# EAGLE schematic untitled (EAGLE 7.2.0)

## Sheet 1 of 6
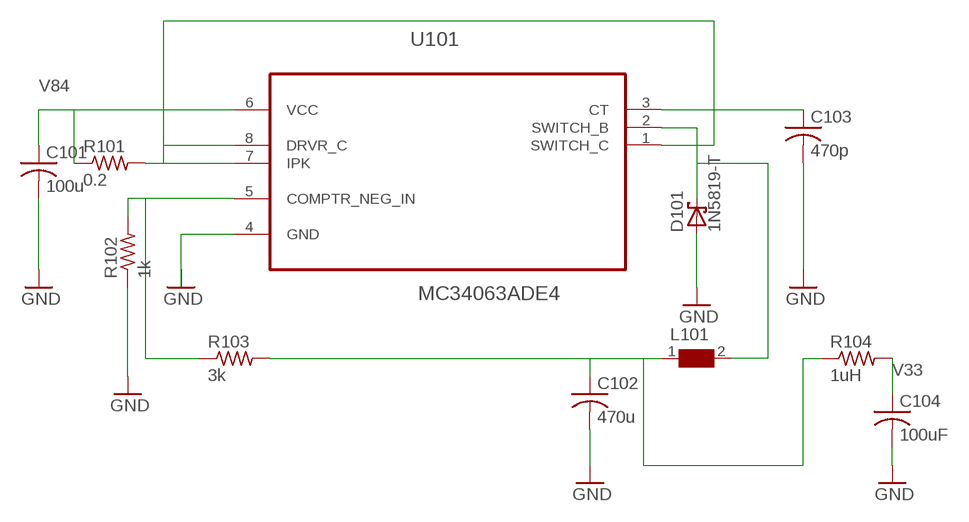
[diagram p0: schematic, sheet 1]

### Parts
C101  100u  C-USC0805  [C0805]
C102  470u  C-USC0805  [C0805]
C103  470p  C-USC0805  [C0805]
C104  100uF  C-USC0805  [C0805]
D101  1N5819-T  [DO41-7.6]
L101  WE-PD-7447714101_1030/1050  [WE-PD_1030/1050]
R101  0.2  R-US_R0805  [R0805]
R102  1k  R-US_R0805  [R0805]
R103  3k  R-US_R0805  [R0805]
R104  1uH  R-US_R0805  [R0805]
U101  MC34063ADE4  [SOIC127P600X175-8N]

### Nets
GND: C101.2 C102.2 C103.2 C104.2 D101.A R102.1 U101.4(GND) ; also sheet 2,3,4,5,6
N$2: C103.1 U101.3(CT)
N$3: R102.2 R103.1 U101.5(COMPTR_NEG_IN)
N$4: C102.1 L101.1 R103.2 R104.1
N$5: R101.2 U101.1(SWITCH_C) U101.7(IPK) U101.8(DRVR_C)
N$6: D101.C L101.2 U101.2(SWITCH_B)
V33: C104.1 R104.2 ; also sheet 4,5,6
V84: C101.1 R101.1 U101.6(VCC) ; also sheet 2,3,5

## Sheet 2 of 6
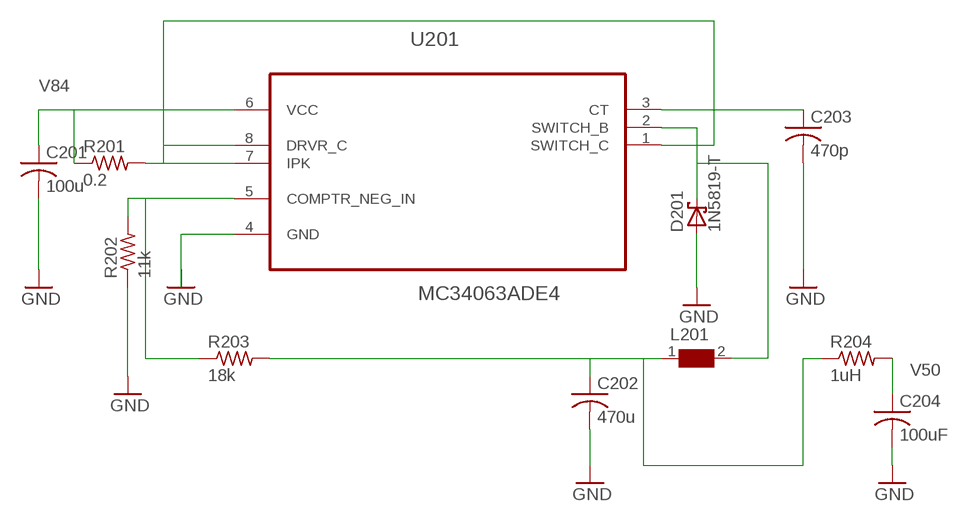
[diagram p1: schematic, sheet 2]

### Parts
C201  100u  C-USC0805  [C0805]
C202  470u  C-USC0805  [C0805]
C203  470p  C-USC0805  [C0805]
C204  100uF  C-USC0805  [C0805]
D201  1N5819-T  [DO41-7.6]
L201  WE-PD-7447714101_1030/1050  [WE-PD_1030/1050]
R201  0.2  R-US_R0805  [R0805]
R202  11k  R-US_R0805  [R0805]
R203  18k  R-US_R0805  [R0805]
R204  1uH  R-US_R0805  [R0805]
U201  MC34063ADE4  [SOIC127P600X175-8N]

### Nets
GND: C201.2 C202.2 C203.2 C204.2 D201.A R202.1 U201.4(GND) ; also sheet 1,3,4,5,6
N$1: C203.1 U201.3(CT)
N$7: R202.2 R203.1 U201.5(COMPTR_NEG_IN)
N$8: C202.1 L201.1 R203.2 R204.1
N$9: R201.2 U201.1(SWITCH_C) U201.7(IPK) U201.8(DRVR_C)
N$10: D201.C L201.2 U201.2(SWITCH_B)
V50: C204.1 R204.2 ; also sheet 5,6
V84: C201.1 R201.1 U201.6(VCC) ; also sheet 1,3,5

## Sheet 3 of 6
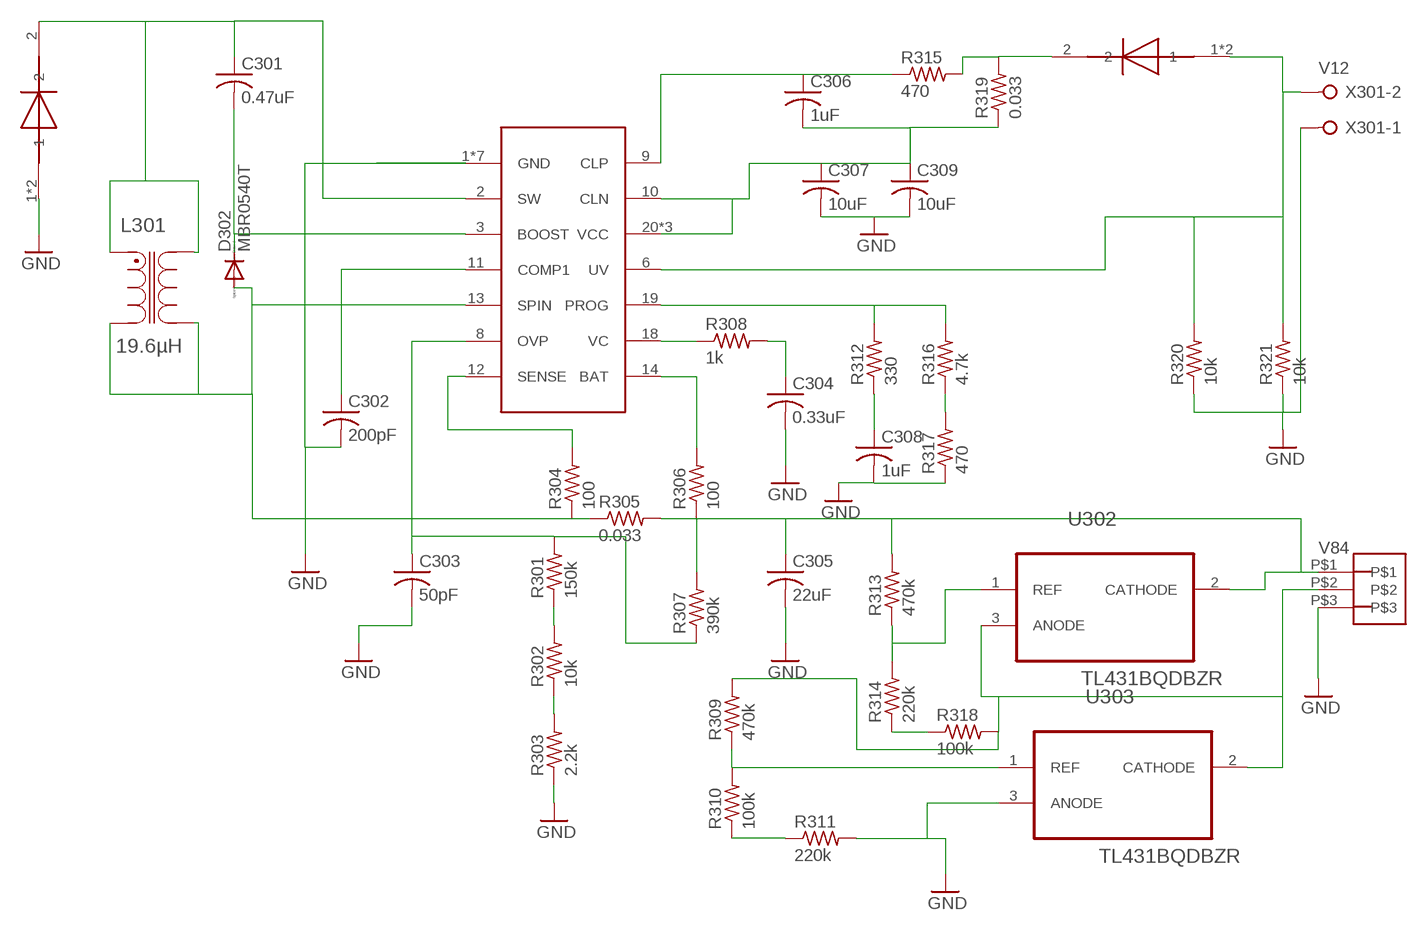
[diagram p2: schematic, sheet 3]

### Parts
C301  0.47uF  C-USC0805  [C0805]
C302  200pF  C-USC0805  [C0805]
C303  50pF  C-USC0805  [C0805]
C304  0.33uF  C-USC0805  [C0805]
C305  22uF  C-USC0805  [C0805]
C306  1uF  C-USC0805  [C0805]
C307  10uF  C-USC0805  [C0805]
C308  1uF  C-USC0805  [C0805]
C309  10uF  C-USC0805  [C0805]
D301  MBRD340  [DPACK]
D302  MBR0540T  CGRM4006-G  [SOD-123_MINI-SMA]
D303  MBRD340  [DPACK]
J301  3_PIN_JST-XH  [3_PIN_JST-XH]
L301  19.6µH  CTX20-4-R  [INDM115115X635N]
R301  150k  R-US_R0805  [R0805]
R302  10k  R-US_R0805  [R0805]
R303  2.2k  R-US_R0805  [R0805]
R304  100  R-US_R0805  [R0805]
R305  0.033  R-US_R0805  [R0805]
R306  100  R-US_R0805  [R0805]
R307  390k  R-US_R0805  [R0805]
R308  1k  R-US_R0805  [R0805]
R309  470k  R-US_R0805  [R0805]
R310  100k  R-US_R0805  [R0805]
R311  220k  R-US_R0805  [R0805]
R312  330  R-US_R0805  [R0805]
R313  470k  R-US_R0805  [R0805]
R314  220k  R-US_R0805  [R0805]
R315  470  R-US_R0805  [R0805]
R316  4.7k  R-US_R0805  [R0805]
R317  470  R-US_R0805  [R0805]
R318  100k  R-US_R0805  [R0805]
R319  0.033  R-US_R0805  [R0805]
R320  10k  R-US_R0805  [R0805]
R321  10k  R-US_R0805  [R0805]
U301  LT1511  [SO24W]
U302  TL431BQDBZR  [SOT95P237X112-3N]
U303  TL431BQDBZR  [SOT95P237X112-3N]
X301  W237-02P  [W237-132]

### Nets
GND: C302.2 C303.2 C304.2 C305.2 C307.2 C308.2 C309.2 D301.1 D301.3 J301.P$3 R303.1 R311.2 R317.1 R320.1 R321.1 U301.1(GND) U301.4(GND) U301.5(GND) U301.7(GND) U301.16(GND) U301.23(GND) U301.24(GND) U303.3(ANODE) X301.1 ; also sheet 1,2,4,5,6
N$11 [power1]: C301.1 D301.2 L301.1 L301.4 U301.2(SW)
N$12 [power1]: D302.A L301.2 L301.3 R304.1 R305.1 U301.13(SPIN)
N$13: C301.2 D302.C U301.3(BOOST)
N$14: C302.1 U301.11(COMP1)
N$15: R304.2 U301.12(SENSE)
N$16: R306.2 U301.14(BAT)
N$17: R308.1 U301.18(VC)
N$18: C304.1 R308.2
N$19: R312.2 R316.2 U301.19(PROG)
N$20: C308.1 R312.1
N$21 [power1]: C306.2 C307.1 C309.1 R319.1 U301.10(CLN) U301.20(VCC) U301.21(VCC) U301.22(VCC)
N$22 [power1]: C306.1 R315.1 U301.9(CLP)
N$23 [power1]: D303.2 R315.2 R319.2
N$24: R301.1 R302.2
N$25 [power1]: R302.1 R303.2
N$26: R316.1 R317.2
N$27 [power1]: C303.1 R301.2 R307.1 U301.8(OVP)
N$28: R314.1 R318.1
N$29: R313.1 R314.2 U302.1(REF)
N$30: R309.1 R310.2 U303.1(REF)
N$31: R310.1 R311.1
N$32: J301.P$2 R309.2 R318.2 U302.3(ANODE) U303.2(CATHODE)
V12 [power1]: D303.1 D303.3 R320.2 R321.2 U301.6(UV) X301.2
V84: C305.1 J301.P$1 R305.2 R306.1 R307.2 R313.2 U302.2(CATHODE) ; also sheet 1,2,5

## Sheet 4 of 6
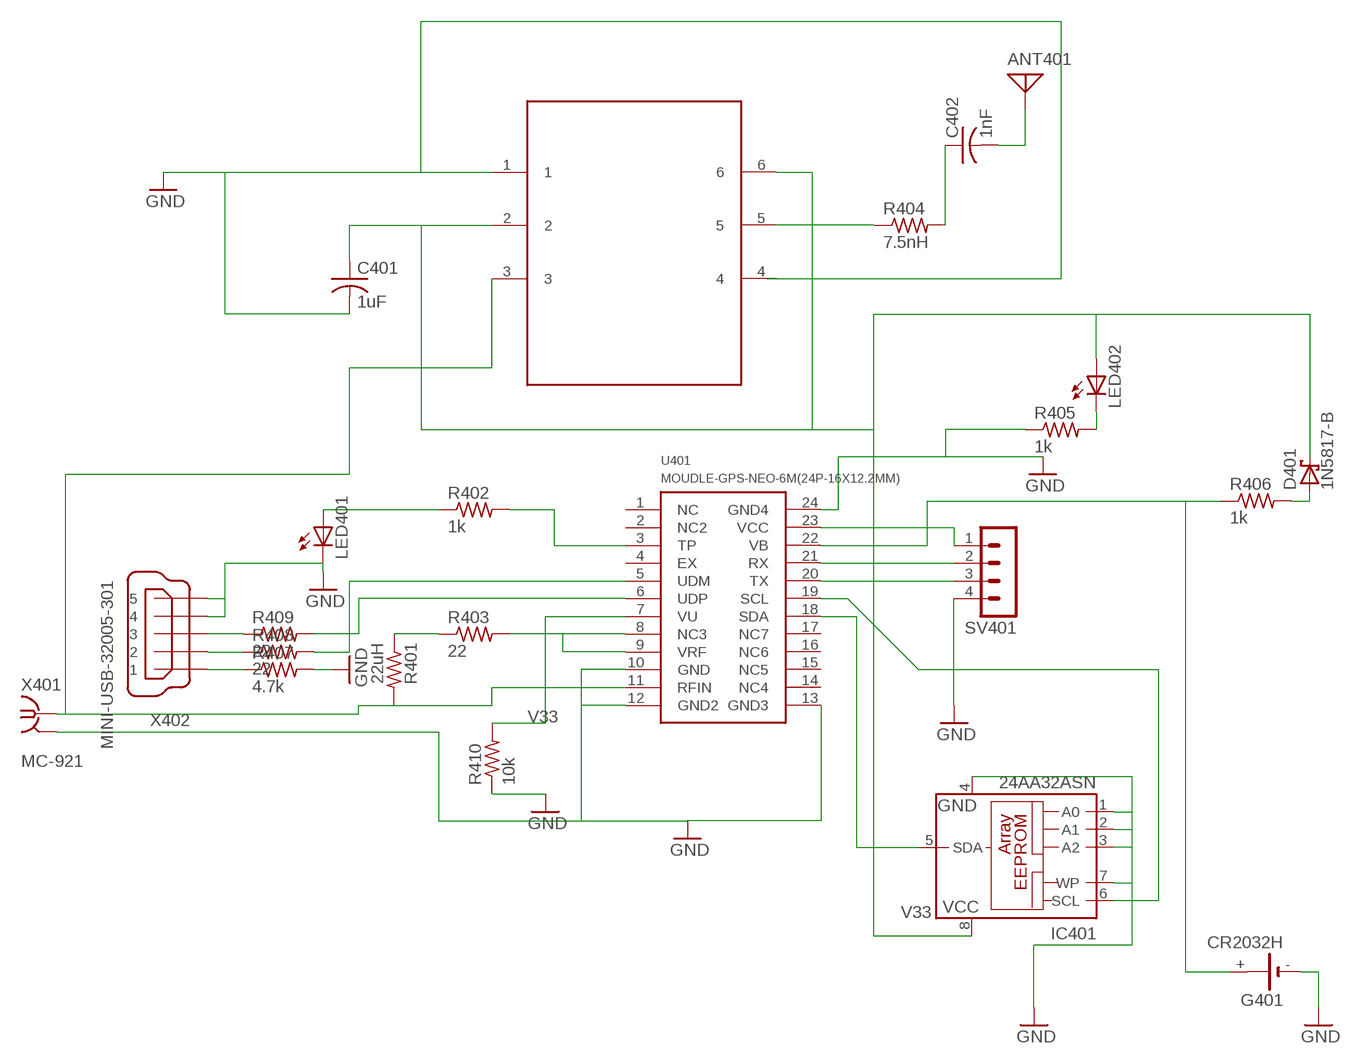
[diagram p3: schematic, sheet 4]

### Parts
ANT401  ANTENNA  [PAD-01]
C401  1uF  C-USC0603  [C0603]
C402  1nF  C-USC0603  [C0603]
D401  1N5817-B  [DO41-7.6]
G401  CR2032H  [CR2032H]
IC401  24AA32ASN  [SO-08]
LED401  LEDCHIP-LED0805  [CHIP-LED0805]
LED402  LEDCHIP-LED0805  [CHIP-LED0805]
R401  22uH  R-US_R0603  [R0603]
R402  1k  R-US_R0805  [R0805]
R403  22  R-US_R0603  [R0603]
R404  7.5nH  R-US_R0603  [R0603]
R405  1k  R-US_R0805  [R0805]
R406  1k  R-US_R0805  [R0805]
R407  4.7k  R-US_R0603  [R0603]
R408  22  R-US_R0603  [R0603]
R409  22  R-US_R0603  [R0603]
R410  10k  R-US_R0603  [R0603]
SV401  MA04-1  [MA04-1]
U401  MOUDLE-GPS-NEO-6M(24P-16X12.2MM)  [GPS24P-SMD-1.1-16X12.2MM]
U402  INF-TSLP-6-2_V_1  [INF-TSLP-6-2_V_1PRIMARY]
X401  MC-921  [MC-921]
X402  MINI-USB-32005-301  [32005-301]

### Nets
GND: C401.2 G401.- IC401.1(A0) IC401.2(A1) IC401.3(A2) IC401.4(GND) IC401.7(WP) LED401.C R405.1 R407.2 R410.1 SV401.4 U401.10(GND) U401.12(GND2) U401.13(GND3) U401.24(GND4) U402.1 X401.2@1(GND) X401.2@2(GND) X402.4 X402.5 ; also sheet 1,2,3,5,6
N$33: LED401.A R402.1
N$34: SV401.3 U401.20(TX)
N$35: SV401.2 U401.21(RX)
N$36: IC401.6(SCL) U401.19(SCL)
N$37: IC401.5(SDA) U401.18(SDA)
N$38: R402.2 U401.3(TP)
N$39: R403.2 U401.8(NC3) U401.9(VRF)
N$40: G401.+ R406.1 U401.22(VB)
N$41: D401.A R406.2
N$42: LED402.C R405.2
N$43: R401.1 R403.1
N$44: R408.2 U401.5(UDM)
N$45: R409.2 U401.6(UDP)
N$46 [power1]: ANT401.1 C402.2
N$47 [power1]: R401.2 U401.11(RFIN) U402.3 X401.1
N$48: R404.1 U402.5
N$49: C402.1 R404.2
N$107: R407.1 X402.1
N$108: R409.1 X402.3
N$109: R408.1 X402.2
V33: C401.1 D401.C IC401.8(VCC) LED402.A R410.2 SV401.1 U401.7(VU) U401.23(VCC) U402.2 U402.6 ; also sheet 1,5,6
Unconnected: G401.+@1(+) U401.1(NC) U401.2(NC2) U401.4(EX) U401.14(NC4) U401.15(NC5) U401.16(NC6) U401.17(NC7) U402.4

## Sheet 5 of 6
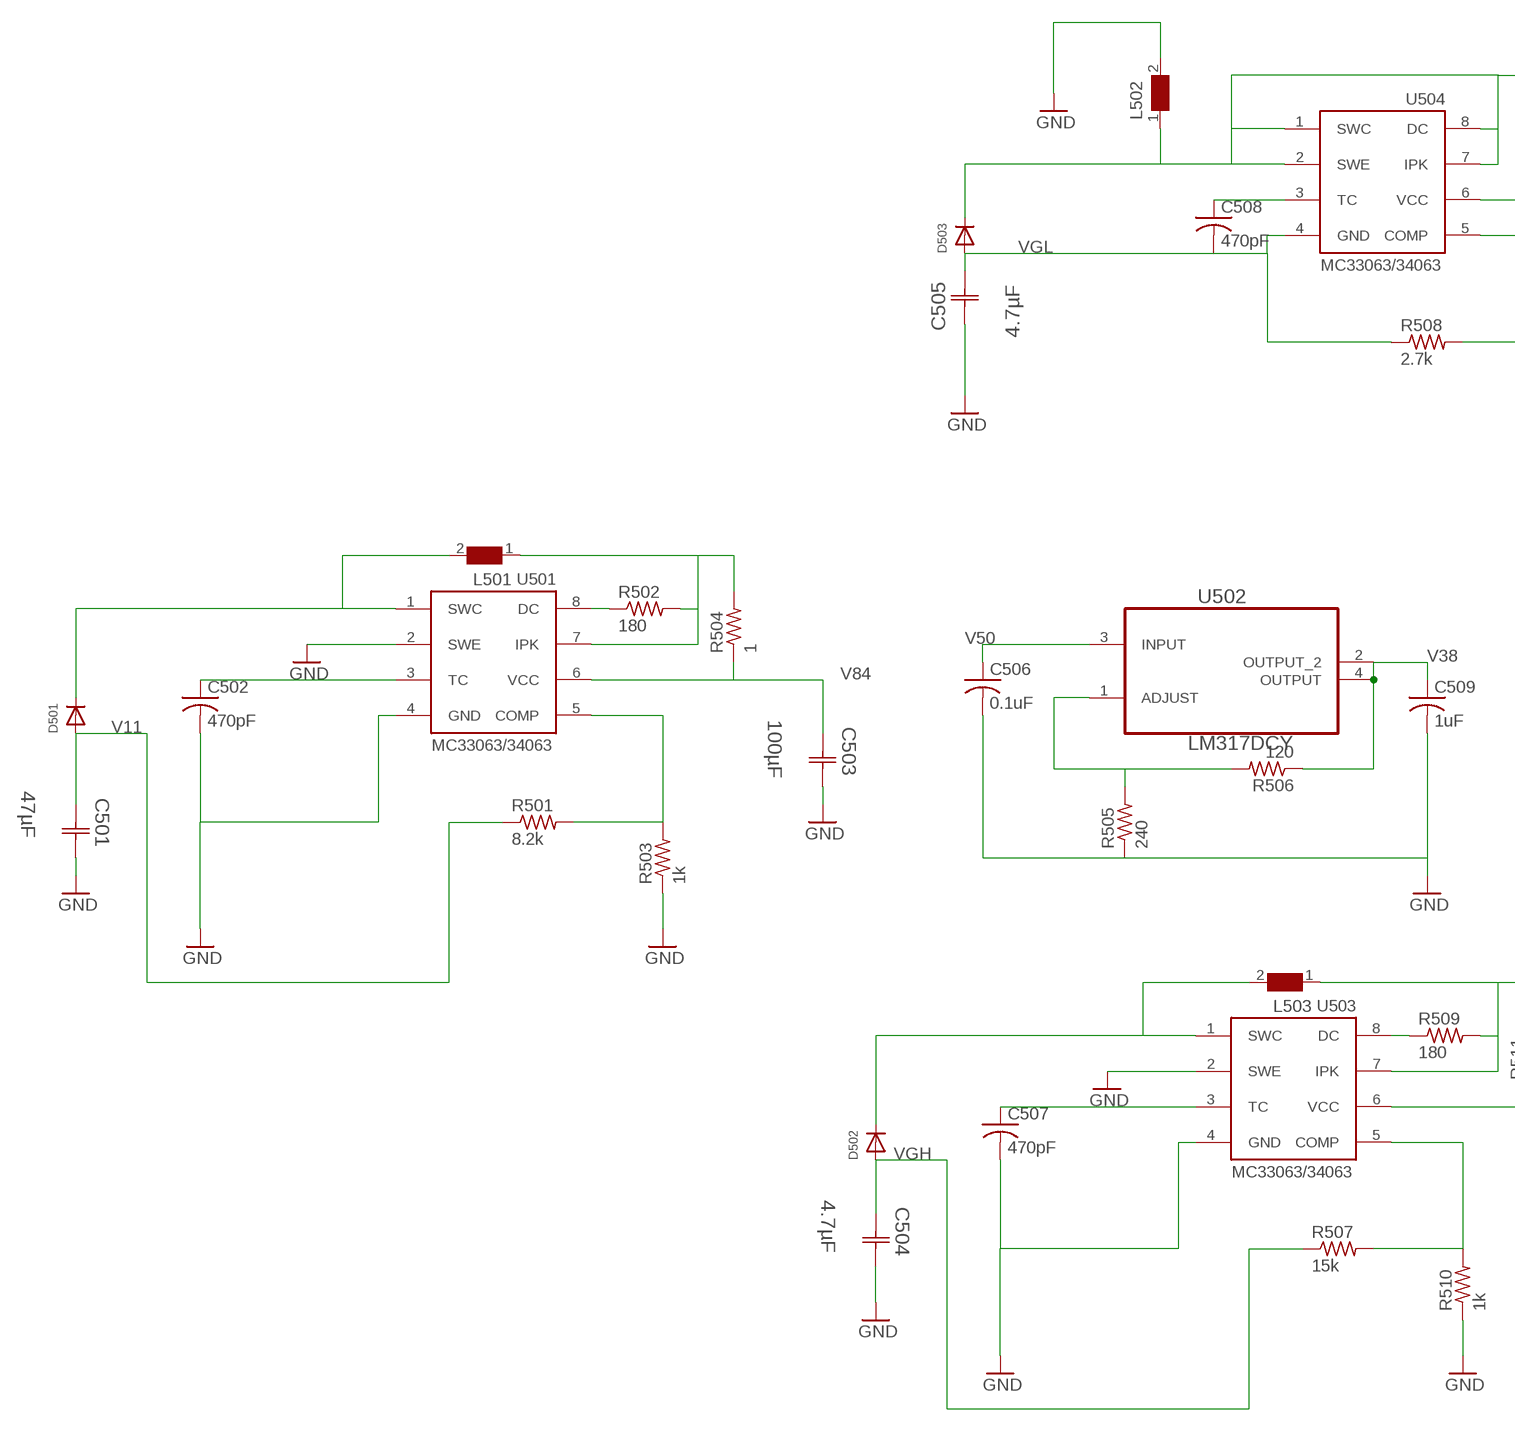
[diagram p4: schematic, sheet 5, part 1 of 3]
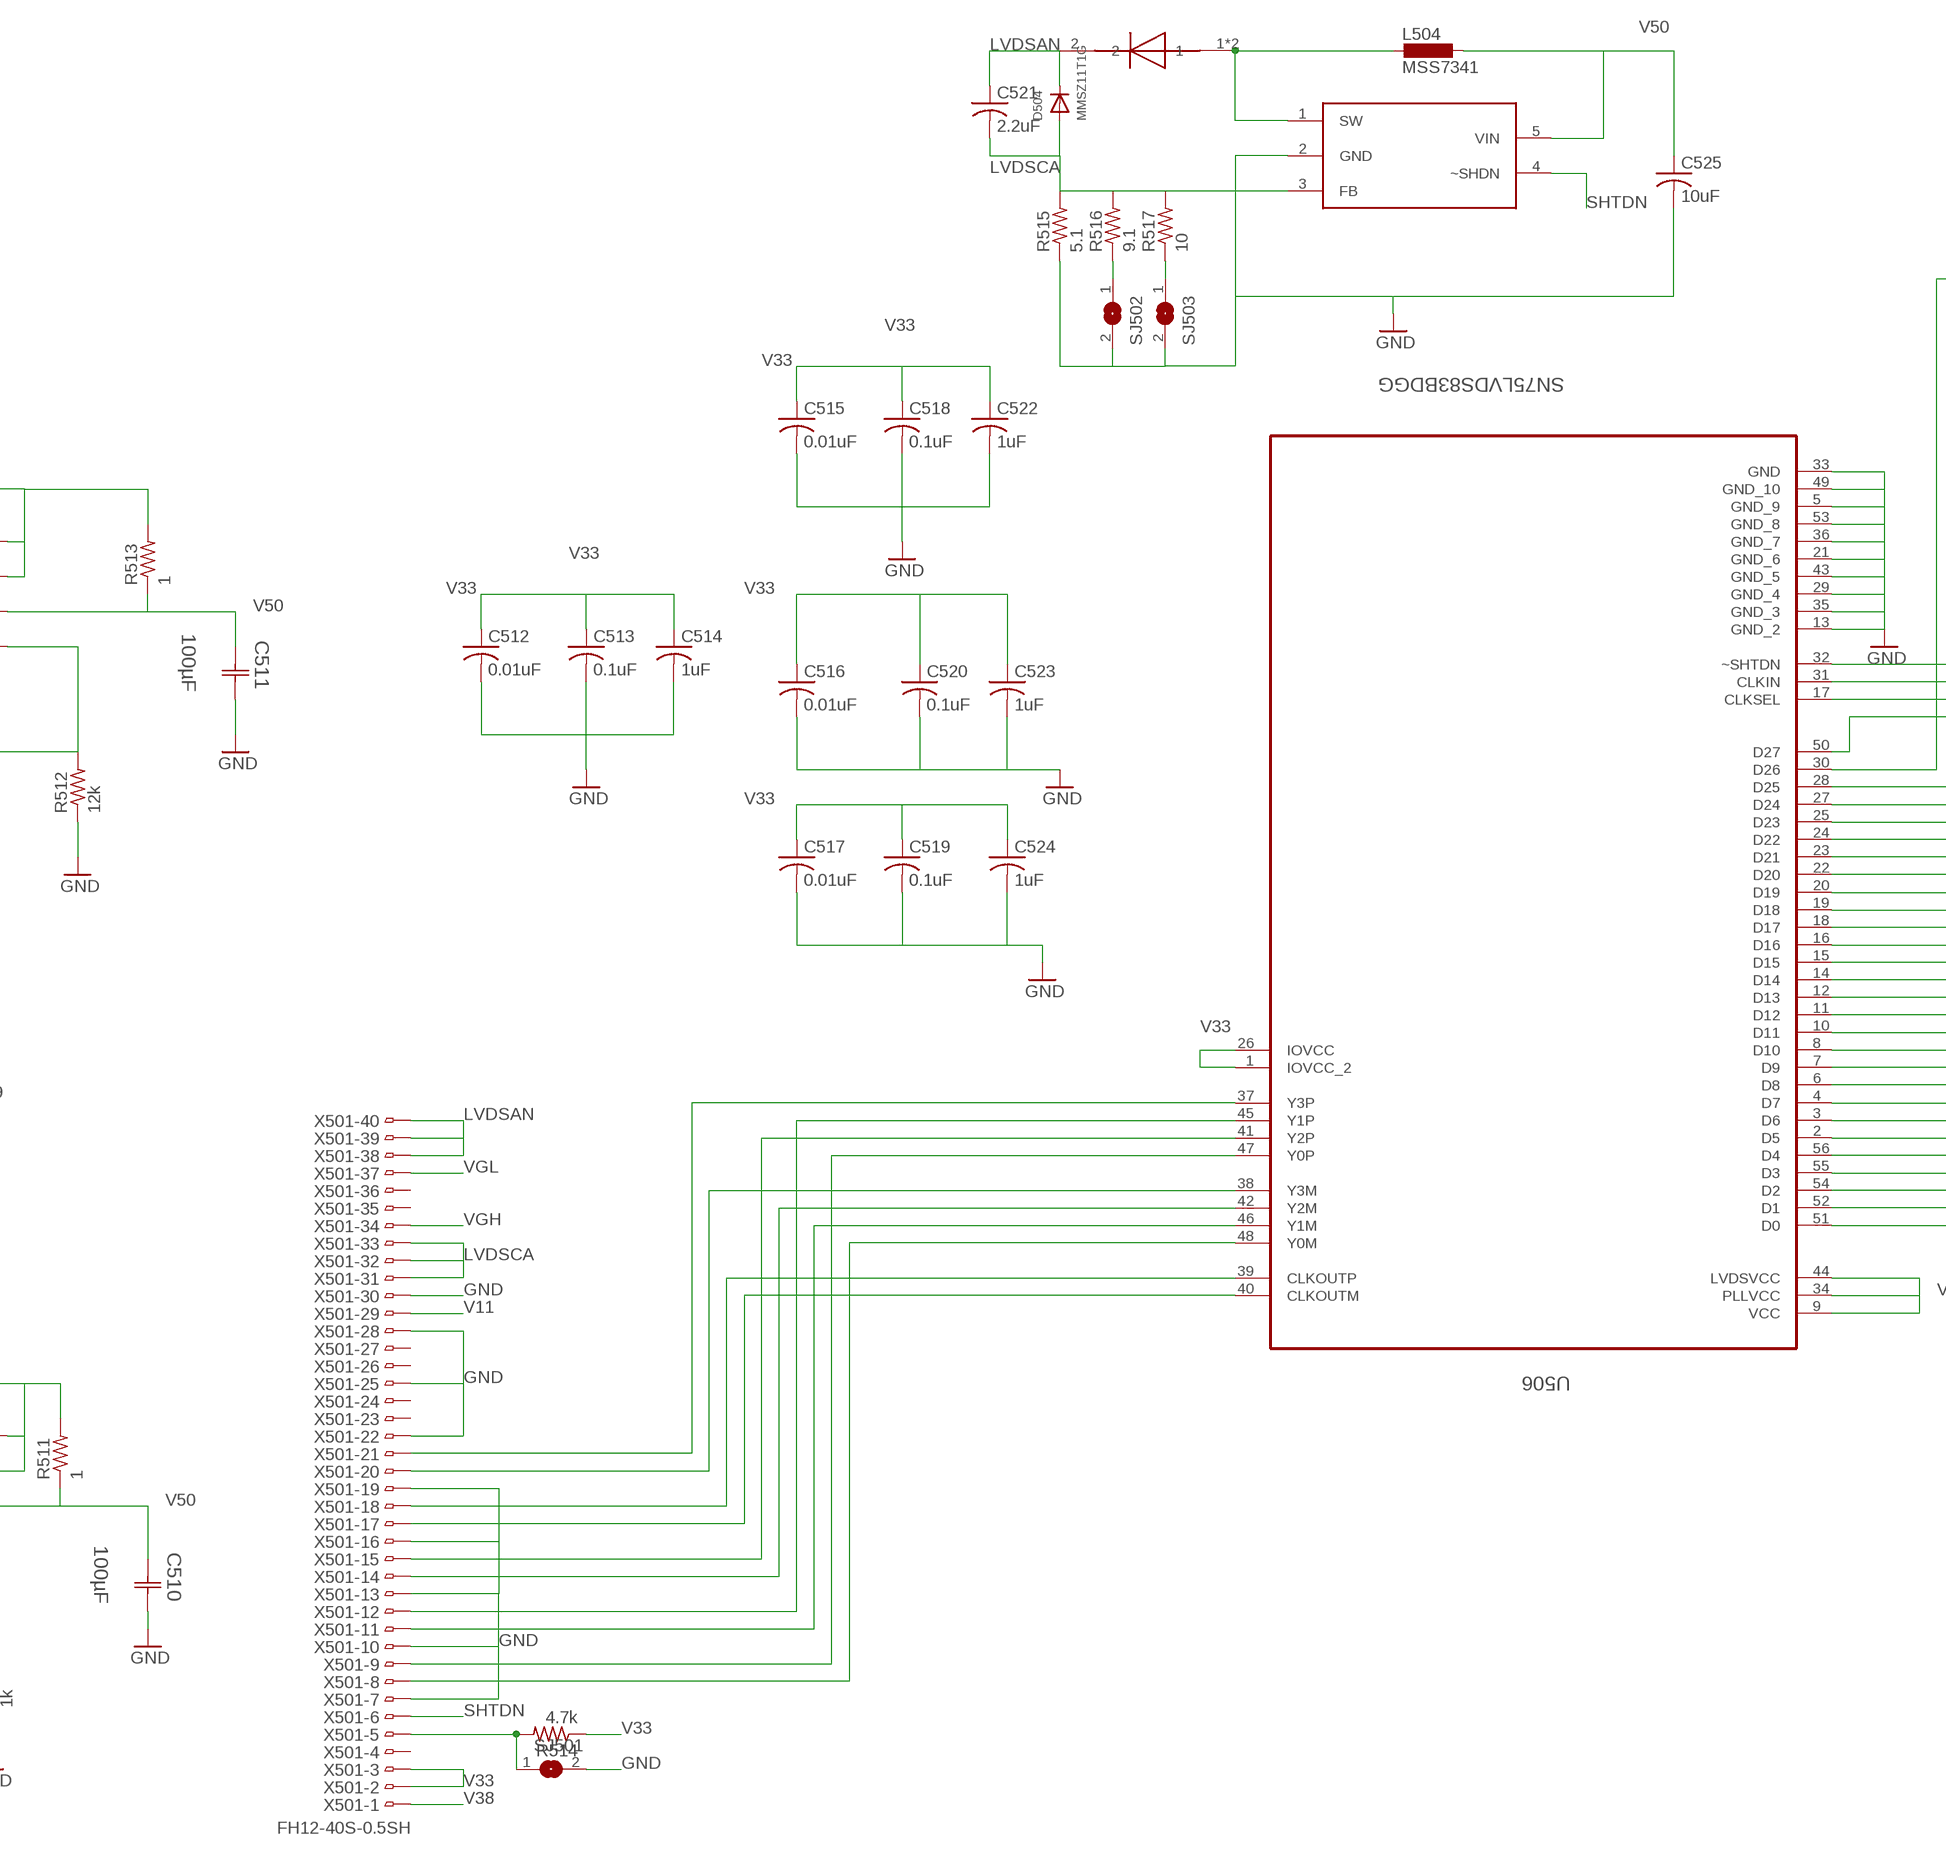
[diagram p5: schematic, sheet 5, part 2 of 3]
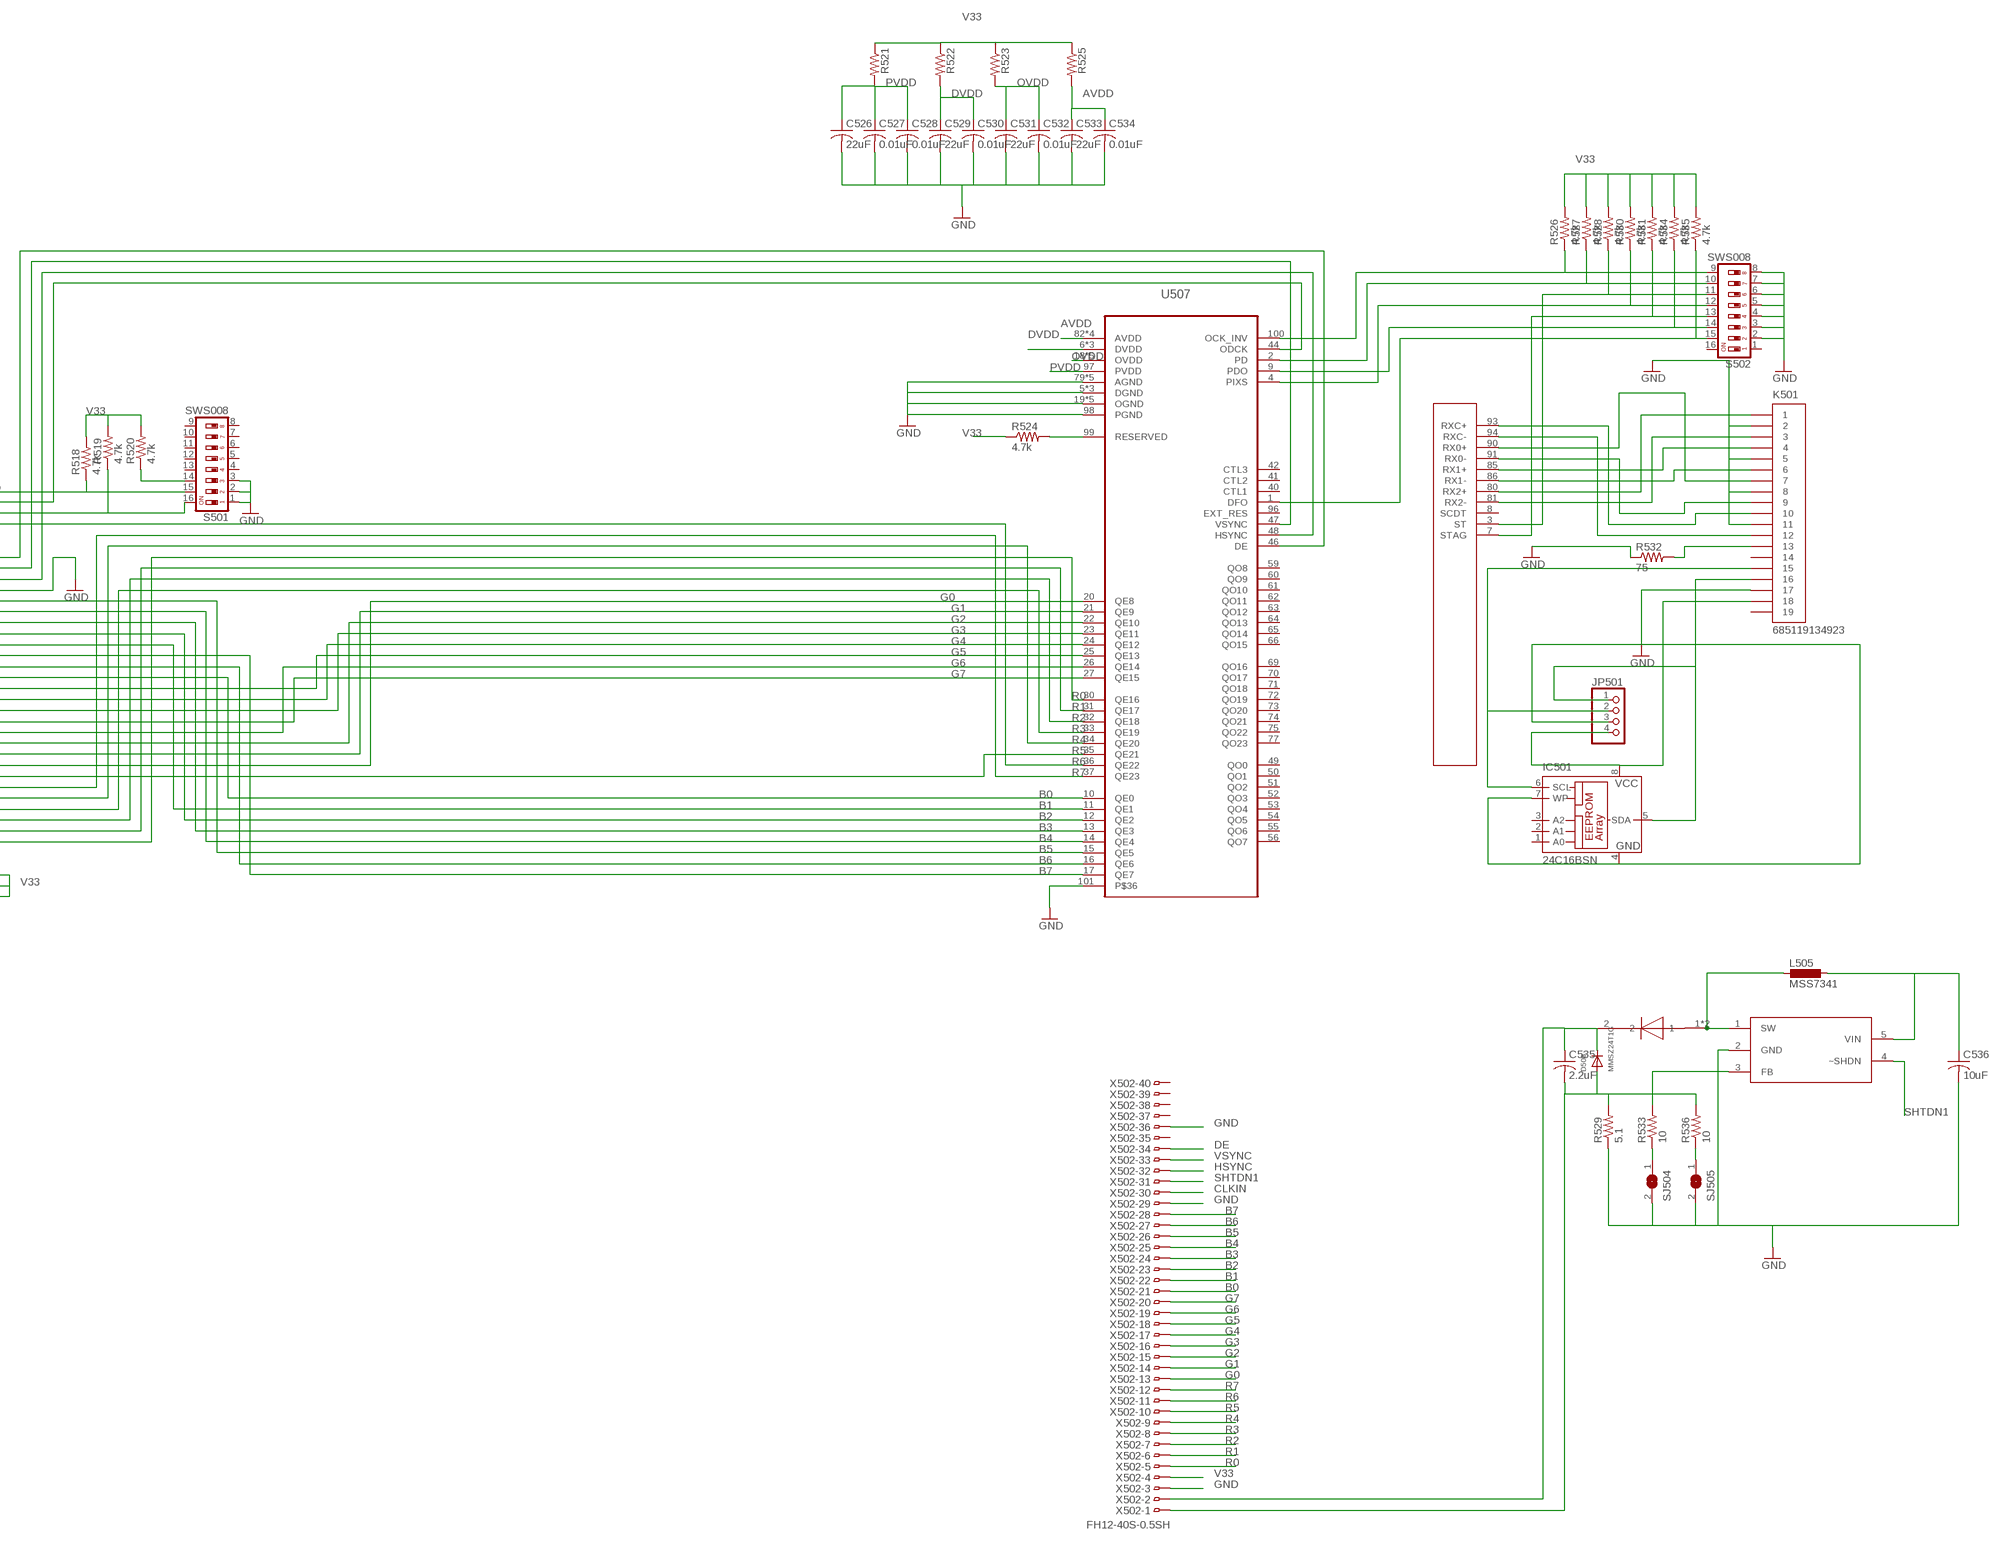
[diagram p6: schematic, sheet 5, part 3 of 3]

### Parts
C501  47µF  TAJC106M020R  [CAPCP6032X280N]
C502  470pF  C-USC0603  [C0603]
C503  100µF  TAJC106M020R  [CAPCP6032X280N]
C504  4.7µF  TAJC106M020R  [CAPCP6032X280N]
C505  4.7µF  TAJC106M020R  [CAPCP6032X280N]
C506  0.1uF  C-USC0603  [C0603]
C507  470pF  C-USC0603  [C0603]
C508  470pF  C-USC0603  [C0603]
C509  1uF  C-USC0603  [C0603]
C510  100µF  TAJC106M020R  [CAPCP6032X280N]
C511  100µF  TAJC106M020R  [CAPCP6032X280N]
C512  0.01uF  C-USC0603  [C0603]
C513  0.1uF  C-USC0603  [C0603]
C514  1uF  C-USC0603  [C0603]
C515  0.01uF  C-USC0603  [C0603]
C516  0.01uF  C-USC0603  [C0603]
C517  0.01uF  C-USC0603  [C0603]
C518  0.1uF  C-USC0603  [C0603]
C519  0.1uF  C-USC0603  [C0603]
C520  0.1uF  C-USC0603  [C0603]
C521  2.2uF  C-USC0805  [C0805]
C522  1uF  C-USC0603  [C0603]
C523  1uF  C-USC0603  [C0603]
C524  1uF  C-USC0603  [C0603]
C525  10uF  C-USC0805  [C0805]
C526  22uF  C-USC0603  [C0603]
C527  0.01uF  C-USC0603  [C0603]
C528  0.01uF  C-USC0603  [C0603]
C529  22uF  C-USC0603  [C0603]
C530  0.01uF  C-USC0603  [C0603]
C531  22uF  C-USC0603  [C0603]
C532  0.01uF  C-USC0603  [C0603]
C533  22uF  C-USC0603  [C0603]
C534  0.01uF  C-USC0603  [C0603]
C535  2.2uF  C-USC0805  [C0805]
C536  10uF  C-USC0805  [C0805]
D501  DIODESOD-123  [SOD-123]
D502  DIODESOD-123  [SOD-123]
D503  DIODESOD-123  [SOD-123]
D504  MMSZ11T1G  DIODESOD-123  [SOD-123]
D505  MBRD340  [DPACK]
D506  MMSZ24T1G  DIODESOD-123  [SOD-123]
D507  MBRD340  [DPACK]
IC501  24C16BSN  [SO-08]
JP501  PINHD-1X4  [1X04]
K501  685119134923  [685119134923]
L501  WE-PD-7447714101_1030/1050  [WE-PD_1030/1050]
L502  WE-PD-7447714101_1030/1050  [WE-PD_1030/1050]
L503  WE-PD-7447714101_1030/1050  [WE-PD_1030/1050]
L504  MSS7341  [MSS7341]
L505  MSS7341  [MSS7341]
R501  8.2k  R-US_R0603  [R0603]
R502  180  R-US_R0603  [R0603]
R503  1k  R-US_R0603  [R0603]
R504  1  R-US_R0603  [R0603]
R505  240  R-US_R0603  [R0603]
R506  120  R-US_R0603  [R0603]
R507  15k  R-US_R0603  [R0603]
R508  2.7k  R-US_R0603  [R0603]
R509  180  R-US_R0603  [R0603]
R510  1k  R-US_R0603  [R0603]
R511  1  R-US_R0603  [R0603]
R512  12k  R-US_R0603  [R0603]
R513  1  R-US_R0603  [R0603]
R514  4.7k  R-US_R0603  [R0603]
R515  5.1  R-US_R0603  [R0603]
R516  9.1  R-US_R0603  [R0603]
R517  10  R-US_R0603  [R0603]
R518  4.7k  R-US_R0603  [R0603]
R519  4.7k  R-US_R0603  [R0603]
R520  4.7k  R-US_R0603  [R0603]
R521  R-US_R0805  [R0805]
R522  R-US_R0805  [R0805]
R523  R-US_R0805  [R0805]
R524  4.7k  R-US_R0603  [R0603]
R525  R-US_R0805  [R0805]
R526  4.7k  R-US_R0603  [R0603]
R527  4.7k  R-US_R0603  [R0603]
R528  4.7k  R-US_R0603  [R0603]
R529  5.1  R-US_R0603  [R0603]
R530  4.7k  R-US_R0603  [R0603]
R531  4.7k  R-US_R0603  [R0603]
R532  75  R-US_R0603  [R0603]
R533  10  R-US_R0603  [R0603]
R534  4.7k  R-US_R0603  [R0603]
R535  4.7k  R-US_R0603  [R0603]
R536  10  R-US_R0603  [R0603]
S501  SWS008  [SMS-008]
S502  SWS008  [SMS-008]
SJ501  SJ  [SJ]
SJ502  SJ  [SJ]
SJ503  SJ  [SJ]
SJ504  SJ  [SJ]
SJ505  SJ  [SJ]
U501  MC33063/MC34063D  [SO08]
U502  LM317DCY  [SOT230P700X180-4N]
U503  MC33063/MC34063D  [SO08]
U504  MC33063/MC34063D  [SO08]
U505  FAN5333BSX  [SOT23-5L]
U506  SN75LVDS83BDGG  [SOP50P810X120-56N]
U507  TPF401  [QFP50P1600X1600X120-101N]
U508  FAN5333BSX  [SOT23-5L]
X501  FH12-40S-0.5SH  [FH12-40S-0.5SH]
X502  FH12-40S-0.5SH  [FH12-40S-0.5SH]

### Nets
AVDD: C533.1 C534.1 R525.2 U507.82(AVDD) U507.84(AVDD) U507.88(AVDD) U507.95(AVDD)
B0: U506.15(D15) U507.10(QE0) X502.21
B1: U506.19(D18) U507.11(QE1) X502.22
B2: U506.20(D19) U507.12(QE2) X502.23
B3: U506.22(D20) U507.13(QE3) X502.24
B4: U506.23(D21) U507.14(QE4) X502.25
B5: U506.24(D22) U507.15(QE5) X502.26
B6: U506.16(D16) U507.16(QE6) X502.27
B7: U506.18(D17) U507.17(QE7) X502.28
CLKIN: U506.31(CLKIN) U507.44(ODCK) X502.30
DE: U506.30(D26) U507.46(DE) X502.34
DVDD: C529.1 C530.1 R522.2 U507.6(DVDD) U507.38(DVDD) U507.67(DVDD)
G0: U506.4(D7) U507.20(QE8) X502.13
G1: U506.6(D8) U507.21(QE9) X502.14
G2: U506.7(D9) U507.22(QE10) X502.15
G3: U506.11(D12) U507.23(QE11) X502.16
G4: U506.12(D13) U507.24(QE12) X502.17
G5: U506.14(D14) U507.25(QE13) X502.18
G6: U506.8(D10) U507.26(QE14) X502.19
G7: U506.10(D11) U507.27(QE15) X502.20
GND: C501.2(C2) C502.2 C503.2(C2) C504.2(C2) C505.1(C1) C506.2 C507.2 C509.2 C510.2(C2) C511.2(C2) C512.2 C513.2 C514.2 C515.2 C516.2 C517.2 C518.2 C519.2 C520.2 C522.2 C523.2 C524.2 C525.2 C526.2 C527.2 C528.2 C529.2 C530.2 C531.2 C532.2 C533.2 C534.2 C536.2 IC501.4(GND) IC501.7(WP) JP501.3 K501.2 K501.5 K501.8 K501.11 K501.17 L502.2 R503.1 R505.1 R510.1 R512.1 R515.1 R529.1 R532.1 S501.1 S501.2 S501.3 S502.2 S502.3 S502.4 S502.5 S502.6 S502.7 S502.8 SJ501.2 SJ502.2 SJ503.2 SJ504.2 SJ505.2 U501.2(SWE) U501.4(GND) U503.2(SWE) U503.4(GND) U505.2(GND) U506.5(GND_9) U506.13(GND_2) U506.21(GND_6) U506.25(D23) U506.29(GND_4) U506.33(GND) U506.35(GND_3) U506.36(GND_7) U506.43(GND_5) U506.49(GND_10) U506.53(GND_8) U507.5(DGND) U507.19(OGND) U507.28(OGND) U507.39(DGND) U507.45(OGND) U507.58(OGND) U507.68(DGND) U507.76(OGND) U507.79(AGND) U507.83(AGND) U507.87(AGND) U507.89(AGND) U507.92(AGND) U507.98(PGND) U507.101 U508.2(GND) X501.7 X501.10 X501.13 X501.16 X501.19 X501.22 X501.25 X501.28 X501.30 X502.3 X502.29 X502.36 ; also sheet 1,2,3,4,6
HSYNC: U506.27(D24) U507.48(HSYNC) X502.32
LVDSAN: C521.1 D504.C D505.2 X501.38 X501.39 X501.40
LVDSCA: C521.2 D504.A R515.2 R516.2 R517.2 U505.3(FB) X501.31 X501.32 X501.33
N$50: R524.2 U507.99(RESERVED)
N$51: R526.1 S502.9 U507.100(OCK_INV)
N$52: R527.1 S502.10 U507.2(PD)
N$53: R528.1 S502.11 U507.3(ST)
N$54: R530.1 S502.12 U507.4(PIXS)
N$55: R531.1 S502.13 U507.7(STAG)
N$56: R534.1 S502.14 U507.9(PDO)
N$57: R535.1 S502.15 U507.1(DFO)
N$58: K501.1 U507.80(RX2+)
N$59: K501.3 U507.81(RX2-)
N$60: K501.4 U507.85(RX1+)
N$61: K501.6 U507.86(RX1-)
N$62: K501.7 U507.90(RX0+)
N$63: K501.9 U507.91(RX0-)
N$64: K501.10 U507.93(RXC+)
N$65: K501.12 U507.94(RXC-)
N$66: IC501.8(VCC) JP501.4 K501.18
N$67: IC501.6(SCL) JP501.2 K501.15
N$68: IC501.5(SDA) JP501.1 K501.16
N$69: K501.13 R532.2
N$70: D505.1 D505.3 L504.1 U505.1(SW)
N$71: R516.1 SJ502.1
N$72: R517.1 SJ503.1
N$73: D507.1 D507.3 L505.1 U508.1(SW)
N$74: C535.1 D506.C D507.2 X502.2
N$75: C535.2 D506.A R529.2 R533.2 R536.2 U508.3(FB) X502.1
N$76: R536.1 SJ505.1
N$77: R533.1 SJ504.1
N$78: C508.1 U504.3(TC)
N$79: D503.C L502.1 R513.2 U504.1(SWC) U504.2(SWE) U504.7(IPK) U504.8(DC)
N$80: R508.2 R512.2 U504.5(COMP)
N$81: U506.37(Y3P) X501.21
N$82: U506.38(Y3M) X501.20
N$83: U506.39(CLKOUTP) X501.18
N$84: U506.40(CLKOUTM) X501.17
N$85: U506.41(Y2P) X501.15
N$86: U506.42(Y2M) X501.14
N$87: U506.45(Y1P) X501.12
N$88: U506.46(Y1M) X501.11
N$89: U506.47(Y0P) X501.9
N$90: U506.48(Y0M) X501.8
N$91: R505.2 R506.2 U502.1(ADJUST)
N$92: R514.2 SJ501.1 X501.5
N$93: R519.1 S501.16 U506.17(CLKSEL)
N$94: C507.1 U503.3(TC)
N$95: D502.C L503.2 U503.1(SWC)
N$96: R507.2 R510.2 U503.5(COMP)
N$97: L503.1 R509.2 R511.2 U503.7(IPK)
N$98: R509.1 U503.8(DC)
N$99: C502.1 U501.3(TC)
N$100: D501.C L501.2 U501.1(SWC)
N$101: R501.2 R503.2 U501.5(COMP)
N$102: L501.1 R502.2 R504.2 U501.7(IPK)
N$103: R502.1 U501.8(DC)
OVDD: C531.1 C532.1 R523.2 U507.18(OVDD) U507.29(OVDD) U507.43(OVDD) U507.57(OVDD) U507.78(OVDD)
PVDD: C526.1 C527.1 C528.1 R521.2 U507.97(PVDD)
R0: U506.51(D0) U507.30(QE16) X502.5
R1: U506.52(D1) U507.31(QE17) X502.6
R2: U506.54(D2) U507.32(QE18) X502.7
R3: U506.55(D3) U507.33(QE19) X502.8
R4: U506.56(D4) U507.34(QE20) X502.9
R5: U506.3(D6) U507.35(QE21) X502.10
R6: U506.50(D27) U507.36(QE22) X502.11
R7: U506.2(D5) U507.37(QE23) X502.12
SHTDN: R518.1 S501.15 U505.4(~SHDN) U506.32(~SHTDN) X501.6
SHTDN1: R520.1 S501.14 U508.4(~SHDN) X502.31
V11: C501.1(C1) D501.A R501.1 X501.29
V33: C512.1 C513.1 C514.1 C515.1 C516.1 C517.1 C518.1 C519.1 C520.1 C522.1 C523.1 C524.1 R514.1 R518.2 R519.2 R520.2 R521.1 R522.1 R523.1 R524.1 R525.1 R526.2 R527.2 R528.2 R530.2 R531.2 R534.2 R535.2 U506.1(IOVCC_2) U506.9(VCC) U506.26(IOVCC) U506.34(PLLVCC) U506.44(LVDSVCC) X501.2 X501.3 X502.4 ; also sheet 1,4,6
V38: C509.1 R506.1 U502.2(OUTPUT_2) U502.4(OUTPUT) X501.1
V50: C506.1 C510.1(C1) C511.1(C1) C525.1 C536.1 L504.2 L505.2 R511.1 R513.1 U502.3(INPUT) U503.6(VCC) U504.6(VCC) U505.5(VIN) U508.5(VIN) ; also sheet 2,6
V84: C503.1(C1) R504.1 U501.6(VCC) ; also sheet 1,2,3
VGH: C504.1(C1) D502.A R507.1 X501.34
VGL: C505.2(C2) C508.2 D503.A R508.1 U504.4(GND) X501.37
VSYNC: U506.28(D25) U507.47(VSYNC) X502.33
Unconnected: IC501.1(A0) IC501.2(A1) IC501.3(A2) K501.14 K501.19 S501.4 S501.5 S501.6 S501.7 S501.8 S501.9 S501.10 S501.11 S501.12 S501.13 S502.1 S502.16 U507.8(SCDT) U507.40(CTL1) U507.41(CTL2) U507.42(CTL3) U507.49(QO0) U507.50(QO1) U507.51(QO2) U507.52(QO3) U507.53(QO4) U507.54(QO5) U507.55(QO6) U507.56(QO7) U507.59(QO8) U507.60(QO9) U507.61(QO10) U507.62(QO11) U507.63(QO12) U507.64(QO13) U507.65(QO14) U507.66(QO15) U507.69(QO16) U507.70(QO17) U507.71(QO18) U507.72(QO19) U507.73(QO20) U507.74(QO21) U507.75(QO22) U507.77(QO23) U507.96(EXT_RES) X501.4 X501.23 X501.24 X501.26 X501.27 X501.35 X501.36 X502.35 X502.37 X502.38 X502.39 X502.40

## Sheet 6 of 6
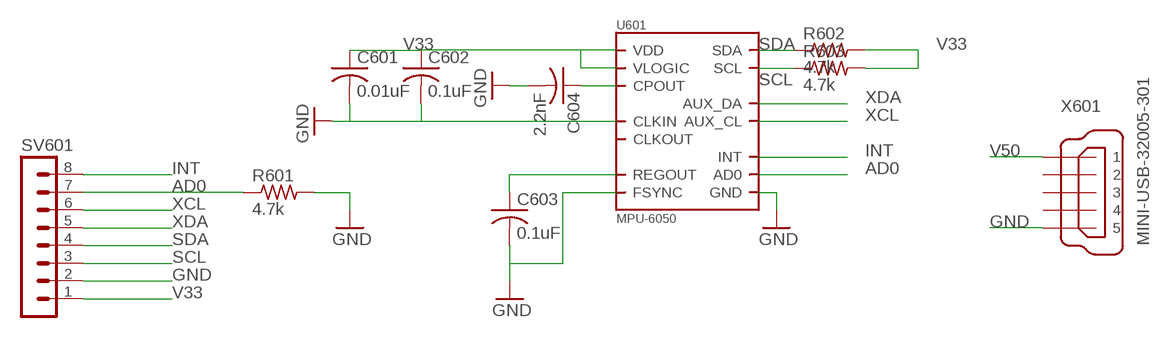
[diagram p7: schematic, sheet 6]

### Parts
C601  0.01uF  C-USC0603  [C0603]
C602  0.1uF  C-USC0603  [C0603]
C603  0.1uF  C-USC0603  [C0603]
C604  2.2nF  C-USC0603  [C0603]
R601  4.7k  R-US_R0603  [R0603]
R602  4.7k  R-US_R0603  [R0603]
R603  4.7k  R-US_R0603  [R0603]
SV601  MA08-1  [MA08-1]
U601  MPU-6050  [QFN.24.4X4]
X601  MINI-USB-32005-301  [32005-301]

### Nets
AD0: R601.1 SV601.7 U601.9(AD0)
GND: C601.2 C602.2 C603.2 C604.2 R601.2 SV601.2 U601.1(CLKIN) U601.11(FSYNC) U601.18(GND) X601.5 ; also sheet 1,2,3,4,5
INT: SV601.8 U601.12(INT)
N$105: C604.1 U601.20(CPOUT)
N$106: C603.1 U601.10(REGOUT)
SCL: R603.1 SV601.3 U601.23(SCL)
SDA: R602.1 SV601.4 U601.24(SDA)
V33: C601.1 C602.1 R602.2 R603.2 SV601.1 U601.8(VLOGIC) U601.13(VDD) ; also sheet 1,4,5
V50: X601.1 ; also sheet 2,5
XCL: SV601.6 U601.7(AUX_CL)
XDA: SV601.5 U601.6(AUX_DA)
Unconnected: U601.22(CLKOUT) X601.2 X601.3 X601.4

## Library data of the parts
ANT401 = discrete:ANTENNA: Antenna
C101-C104 C201-C204 C401 C402 = rcl:C-US: CAPACITOR, American symbol
C301-C309 C601-C604 = resistor:C-US: CAPACITOR, American symbol
C501 C503-C505 C510 C511 = AVX_By_element14_Batch_1:TAJC106M020R: Tantalum Capacitor , 2312; CAPACITANCETOLERANCE: ±20%; MPN: TAJC106M020R; OC_FARNELL: -; OC_NEWARK: 75M2822; SUPPLIER: AVX; VALUE: 10µF; VOLTAGERATING: 20V
C502 C506-C509 C512-C536 = adafruit:C-US: CAPACITOR, American symbol
D101 D201 D401 = diode:1N581*: 1.0A SCHOTTKY BARRIER RECTIFIER Source: http://www.diodes.com/datasheets/ds23001.pdf
D301 D303 D505 D507 = linear:MBRD340
D302 = diode:CGRM400*-G: Molded plasitc,JEDEC SOD-123/Mini SMA Source: Comchip CGRM4001-G.pdf
D501-D504 D506 = adafruit:DIODE: Diode SMADIODE - SMA Surface Mount Package 20V 1A Schottky Diode Digikey: 641-1014-6-ND DO-1N4148 - Through Hole Small Current Diode SOD-123 20V 1 A (.5mV Vf) Schottky Diode - Digikey: MBRX120TPMSCT-ND SOD-323 10V 570mA (.38mV Vf, 3ns) Schottky Diode - Digikey: ZLLS410CT-ND SOD-523 30V 30mA Schottky Diode (RB751S-40TE61) - Digikey: RB751S-40TE61CT-ND SOT23-R/W - SOT23 Package (R = Solder Paste/Reflow Ovens, W = Hand-Soldering) BAT54Film 40V 300mA - Digikey: 497-7162-1-ND
G401 = battery:CR2032H: LI BATTERY Varta
IC401 = microchip:24*: Serial EEPROM I2C; MF: MICROCHIP; MPN: 24AA32A-I/SN; OC_FARNELL: 1617659; OC_NEWARK: 83C5815
IC501 = microchip:24*: Serial EEPROM I2C; MPN: AT24C16BN-SH-B; OC_FARNELL: 1362651; OC_NEWARK: 50M3324
J301 = JST-XH_HEADERS:3_PIN_JST-XH
JP501 = pinhead:PINHD-1X4: PIN HEADER
K501 = Eagle_INPUT_OUTPUT_CONNECTORS_rev15d:685119134923: WR-COM SMT Horizontal HDMI, 19 pins=>Code : Con_I-O_COM_HDMI_685119134923 <http://katalog.we-online.de/media/images/eican/Con_I-O_COM_HDMI_685119134923_pf2.jpg> Details see: http://katalog.we-online.de/en/em/685_119_134_923 Created 2014-07-09, Karrer Zheng 2014 (C) Würth Elektronik
L101 L201 L501-L503 = WE-PD:WE-PD: SMD-Shielded Power Inductors WE-PD - Magnetically shielded version which results in a low leakage field - High storage capacity - Low self-losses - Highest possible current loading for SMD-Inducors -- Switching regulators with low operating voltages (computer, laptop, mobile phones, pagers) -- Integrated DC/DC-converter -- Is recommended for the application with switching regulators from National Semiconductor, Linear Technology, Texas Instruments and Fairchild Semiconductor, ect. -- Graphic cards -- Plastic base: Because of the one piece construction these are more suitable for high vibration or shock applications; MPN: 7447714101; OC_FARNELL: 2082677; OC_NEWARK: 88T7105; PACKAGE: 1050; SUPPLIER: Wuerth Elektronik
L301 = coiltronics:CTX20-4-R: POWER INDUCTOR; CURRENT: 1.05A; MPN: CTX20-4-R; OC_FARNELL: 1463498; OC_NEWARK: 29K6542; PACKAGE: SMD; SUPPLIER: Coiltronics; TOLERANCE: ± 20%
L504 L505 = inductor-coilcraft:MSS7341: Shielded Power Inductors Package 6.6 × 6.6 mm x 4.1 mm high Source: http://www.farnell.com/datasheets/1681958.pdf
LED401 LED402 = led:LED: LED OSRAM: - CHIPLED LG R971, LG N971, LY N971, LG Q971, LY Q971, LO R971, LY R971 LH N974, LH R974 LS Q976, LO Q976, LY Q976 LO Q996 - Hyper CHIPLED LW Q18S LB Q993, LB Q99A, LB R99A - SideLED LS A670, LO A670, LY A670, LG A670, LP A670 LB A673, LV A673, LT A673, LW A673 LH A674 LY A675 LS A676, LA A676, LO A676, LY A676, LW A676 LS A679, LY A679, LG A679 - Hyper Micro SIDELED® LS Y876, LA Y876, LO Y876, LY Y876 LT Y87S - SmartLED LW L88C, LW L88S LB L89C, LB L89S, LG L890 LS L89K, LO L89K, LY L89K LS L896, LA L896, LO L896, LY L896 - TOPLED LS T670, LO T670, LY T670, LG T670, LP T670 LSG T670, LSP T670, LSY T670, LOP T670, LYG T670 LG T671, LOG T671, LSG T671 LB T673, LV T673, LT T673, LW T673 LH T674 LS T676, LA T676, LO T676, LY T676, LB T676, LH T676, LSB T676, LW T676 LB T67C, LV T67C, LT T67C, LS T67K, LO T67K, LY T67K, LW E67C LS E67B, LA E67B, LO E67B, LY E67B, LB E67C, LV E67C, LT E67C LW T67C LS T679, LY T679, LG T679 LS T770, LO T770, LY T770, LG T770, LP T770 LB T773, LV T773, LT T773, LW T773 LH T774 LS E675, LA E675, LY E675, LS T675 LS T776, LA T776, LO T776, LY T776, LB T776 LHGB T686 LT T68C, LB T68C - Hyper Mini TOPLED® LB M676 - Mini TOPLED Santana® LG M470 LS M47K, LO M47K, LY M47K Source: http://www.osram.convergy.de LUXEON: - LUMILED® LXK2-PW12-R00, LXK2-PW12-S00, LXK2-PW14-U00, LXK2-PW14-V00 LXK2-PM12-R00, LXK2-PM12-S00, LXK2-PM14-U00 LXK2-PE12-Q00, LXK2-PE12-R00, LXK2-PE12-S00, LXK2-PE14-T00, LXK2-PE14-U00 LXK2-PB12-K00, LXK2-PB12-L00, LXK2-PB12-M00, LXK2-PB14-N00, LXK2-PB14-P00, LXK2-PB14-Q00 LXK2-PR12-L00, LXK2-PR12-M00, LXK2-PR14-Q00, LXK2-PR14-R00 LXK2-PD12-Q00, LXK2-PD12-R00, LXK2-PD12-S00 LXK2-PH12-R00, LXK2-PH12-S00 LXK2-PL12-P00, LXK2-PL12-Q00, LXK2-PL12-R00 Source: www.luxeon.com KINGBRIGHT: KA-3528ASYC Source: www.kingbright.com
R101 R102 R104 R201 R202 R204 R301-R321 R401-R410 R518-R520 R601-R603 = resistor:R-US_: RESISTOR, American symbol
R103 R203 = rcl:R-US_: RESISTOR, American symbol
R501-R517 R521-R536 = adafruit:R-US_: RESISTOR, American symbol
S501 S502 = smd-special:SWS008: SMD Dip Switch 8 pol.
SJ501-SJ505 = jumper:SJ: SMD solder JUMPER
SV401 = con-lstb:MA04-1: PIN HEADER; OC_FARNELL: unknown; OC_NEWARK: unknown
SV601 = con-lstb:MA08-1: PIN HEADER; OC_FARNELL: unknown; OC_NEWARK: unknown
U101 U201 = Texas Instruments_By_element14_Batch_1:MC34063ADE4: REGULATORS; MPN: MC34063ADE4; OC_FARNELL: 1053582; OC_NEWARK: 97K4678; PACKAGE: SOIC-8; SUPPLIER: TI
U301 = 74xx-us:LT1511
U302 U303 = Texas Instruments_By_element14_Batch_1:TL431BQDBZR: PRECISION PROGRAMMABLE REFERENCE; MPN: TL431BQDBZR; OC_FARNELL: 1764815; OC_NEWARK: 44J2402; PACKAGE: SOT23-3; SUPPLIER: Texas Instruments
U401 = MOUDLE-GPS-NEO-6M_24P-16X12.2MM_:MOUDLE-GPS-NEO-6M(24P-16X12.2MM): 317050000
U402 = INF-TSLP-6-2_V:INF-TSLP-6-2_V_1
U501 U503 U504 = adafruit:MC33063/MC34063: MC33063 and MC34063 Basic DC/DC converter with internal power-NPN transistor, 100KHz, 1.5A peak switch current. 3-40 input/output.
U502 = Texas Instruments_By_element14_Batch_1:LM317DCY: IC ADJ LINEAR REG 1.25V TO 37V; MPN: LM317DCY; OC_FARNELL: 1626539; OC_NEWARK: 75C0809; PACKAGE: SOT-223-3; SUPPLIER: TEXAS INSTRUMENTS
U505 U508 = adafruit:FAN5333BSX
U506 = Texas Instruments_By_element14_Batch_1:SN75LVDS83BDGG: FLATLINK? TRANSMITTER; MPN: SN75LVDS83BDGG; OC_FARNELL: 1786537; OC_NEWARK: 11R7398; PACKAGE: TSSOP-56; SUPPLIER: Texas Instruments
U507 = qpf100:TPF401
U601 = MPU6040QFN:MPU-6050
X301 = con-wago-508:W237-02P: WAGO SREW CLAMP; OC_FARNELL: unknown; OC_NEWARK: unknown
X401 = con-coax:MC-921: COAX. MICROWAVE CONNECTOR O/D diam 2.1 Source: www.tycoelectronics.com .. Electronics .. ENG_CD_1775146_A2.pdf; OC_FARNELL: unknown; OC_NEWARK: unknown
X402 X601 = con-cypressindustries:MINI-USB-: MINI USB-B Conector Source: www.cypressindustries.com; OC_FARNELL: unknown; OC_NEWARK: unknown
X501 X502 = con-hirose:FH12-40S-0.5S: 0.5mm Pitch Connectors For FPC/FFC Source: Data sheet <http://www.hirose.co.jp/cataloge_hp/e58605370.pdf>; MPN: FH12-40S-0.5SH(55); OC_FARNELL: 1324556; OC_NEWARK: 34M6178

## Net classes
1 power1: width 0.813 mm, drill 0.813 mm, clearance 0.125 mm